# EAGLE schematic t10 arduino prog (EAGLE 6.1)
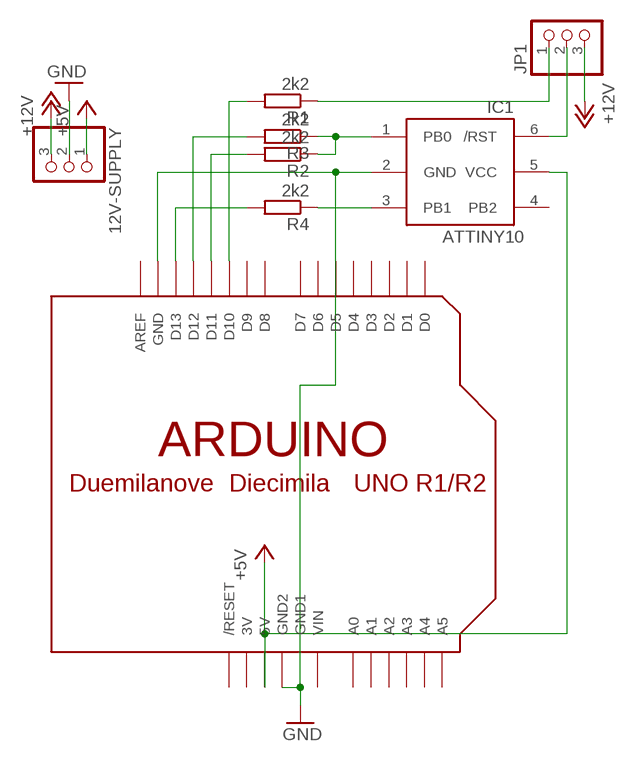
[diagram p0: schematic, sheet 1]

## Parts
12V-SUPPLY  PINHD-1X3/90  [1X03/90]
IC1  ATTINY10  [SOT23-6]
JP1  PINHD-1X3  [1X03]
R1  2k2  R-EU_0207/2V  [0207/2V]
R2  2k2  R-EU_0207/2V  [0207/2V]
R3  2k2  R-EU_0207/2V  [0207/2V]
R4  2k2  R-EU_0207/2V  [0207/2V]
U$1  ARDUINO-NOHOLE  [ARDUINO-NOHOLE]

## Nets
+5V: 12V-SUPPLY.1 IC1.5(VCC) U$1.5V
+12V: 12V-SUPPLY.3 JP1.3
GND: 12V-SUPPLY.2 IC1.2(GND) U$1.GND U$1.GND1 U$1.GND2
N$5: R1.2 U$1.D10
N$6: R2.2 U$1.D11
N$7: R3.2 U$1.D12
N$8: R4.2 U$1.D13
N$9: IC1.1(PB0) R2.1 R3.1
N$10: IC1.3(PB1) R4.1
N$11: JP1.1 R1.1
N$12: IC1.6(/RST) JP1.2
Unconnected: IC1.4(PB2) U$1.A0 U$1.A1 U$1.A2 U$1.A3 U$1.A4 U$1.A5 U$1.AREF U$1.D0 U$1.D1 U$1.D2 U$1.D3 U$1.D4 U$1.D5 U$1.D6 U$1.D7 U$1.D8 U$1.D9 U$1.RESET(/RESET)

## Power pins joined to a net without a drawn wire
3V: U$1.3V
VIN: U$1.VIN

## Library data of the parts
12V-SUPPLY JP1 = pinhead:PINHD-1X3: PIN HEADER
IC1 = adafruit:ATTINY10: ATtiny4/5/9/10 8-bit Microcontroller with 512/1024 Bytes In-System Programmable Flash
R1-R4 = rcl:R-EU_: RESISTOR, European symbol
U$1 = adafruit:ARDUINO: Arduino Diecimila/Duemilanove Make a shield with ease, this package has all the named pins as well as the two mounting drill holes and an outline of the USB and DC power connector. The outline is on the DIMENSION layer, so if your board house uses it they will cut the outline to match. http://www.ladyada.net/library/pcb/eaglelibrary.html